# EAGLE schematic BMS Thermistor ECU rev1 (EAGLE 8.4.1)
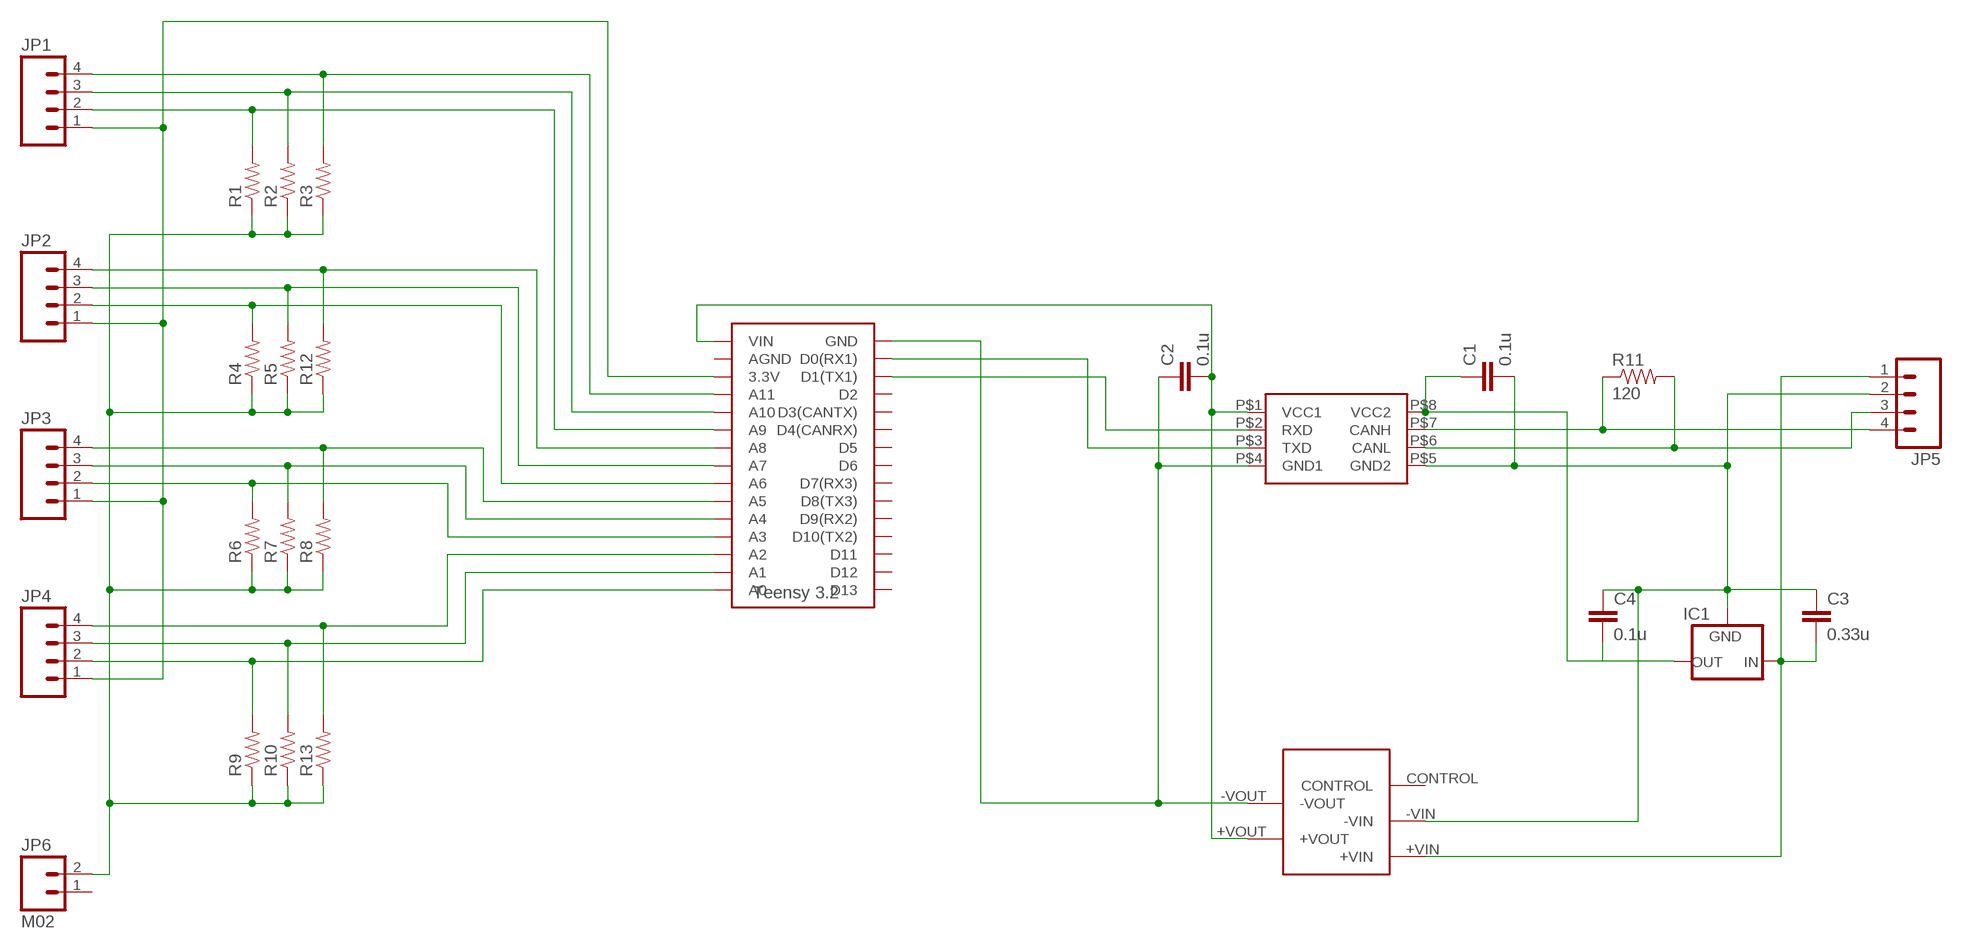
[diagram p0: schematic, sheet 1]

## Parts
C1  0.1u  CAP0805  [0805]
C2  0.1u  CAP0805  [0805]
C3  0.33u  CAP0805  [0805]
C4  0.1u  CAP0805  [0805]
IC1  5VREG_L7805SPACED  [TO-220-SPACED]
JP1  M04  [1X04]
JP2  M04  [1X04]
JP3  M04  [1X04]
JP4  M04  [1X04]
JP5  M04  [1X04]
JP6  M02  [1X02]
R1  RESISTOR0805-RES  [0805]
R2  RESISTOR0805-RES  [0805]
R3  RESISTOR0805-RES  [0805]
R4  RESISTOR0805-RES  [0805]
R5  RESISTOR0805-RES  [0805]
R6  RESISTOR0805-RES  [0805]
R7  RESISTOR0805-RES  [0805]
R8  RESISTOR0805-RES  [0805]
R9  RESISTOR0805-RES  [0805]
R10  RESISTOR0805-RES  [0805]
R11  120  RESISTOR0805-RES  [0805]
R12  RESISTOR0805-RES  [0805]
R13  RESISTOR0805-RES  [0805]
U$1  TEENSY_3.2_12ANALOG  [TEENSY_3.2_12ANALOG]
U$2  ISO1050CAN  [DUB8]
U$3  NCS1S1205SC-12V-5VCONVERTER  [DCDC-CONVERTER]

## Nets
3.3V: JP1.1 JP2.1 JP3.1 JP4.1 U$1.3.3V
N$1: C1.2 C3.1 C4.1 IC1.2(GND) JP5.2 U$2.P$5(GND2) U$3.-VIN
N$2: JP3.3 R7.2 U$1.A4
N$3: JP3.4 R8.2 U$1.A5
N$4: C3.2 IC1.1(IN) JP5.1 U$3.+VIN
N$5: C1.1 C4.2 IC1.3(OUT) U$2.P$8(VCC2)
N$6: JP5.4 R11.1 U$2.P$7(CANH)
N$7: JP5.3 R11.2 U$2.P$6(CANL)
N$8: U$1.D0(RX1) U$2.P$3(TXD)
N$9: U$1.D1(TX1) U$2.P$2(RXD)
N$10: C2.2 U$1.VIN U$2.P$1(VCC1) U$3.+VOUT
N$11: C2.1 U$1.GND U$2.P$4(GND1) U$3.-VOUT
N$12: JP2.4 R12.2 U$1.A8
N$13: JP4.4 R13.2 U$1.A2
THERM1: JP1.2 R1.2 U$1.A9
THERM2: JP1.3 R2.2 U$1.A10
THERM3: JP1.4 R3.2 U$1.A11
THERM4: JP2.2 R4.2 U$1.A6
THERM5: JP2.3 R5.2 U$1.A7
THERM6: JP3.2 R6.2 U$1.A3
THERM9: JP4.2 R9.2 U$1.A0
THERM10: JP4.3 R10.2 U$1.A1
TS_GND: JP6.2 R1.1 R2.1 R3.1 R4.1 R5.1 R6.1 R7.1 R8.1 R9.1 R10.1 R12.1 R13.1
Unconnected: JP6.1 U$1.AGND U$1.D2 U$1.D3(CANTX) U$1.D4(CANRX) U$1.D5 U$1.D6 U$1.D7(RX3) U$1.D8(TX3) U$1.D9(RX2) U$1.D10(TX2) U$1.D11 U$1.D12 U$1.D13 U$3.CONTROL

## Library data of the parts
C1-C4 = HyTechDevices:CAP: Capacitor Standard 0603 ceramic capacitor, and 0.1" leaded capacitor.
IC1 = HyTechDevices:5VREG_L7805: Voltage Regulator Switching 5v regulator Datasheet <http://power.murata.com/data/power/oki-78sr.pdf> Standard 7805 5V regulator. IGO (Input Ground Output). Spark Fun Electronics SKU : COM-00107 Datasheet <http://www.mouser.com/ds/2/308/MC7800-D-94905.pdf>
JP1-JP5 = HyTechDevices:M04: Standard 4-pin 0.1" header. NOTES ON THE VARIANTS LOCK and LOCK_LONGPADS... This footprint was designed to help hold the alignment of a through-hole component (i.e. 6-pin header) while soldering it into place. You may notice that each hole has been shifted either up or down by 0.005 of an inch from it's more standard position (which is a perfectly straight line). This slight alteration caused the pins (the squares in the middle) to touch the edges of the holes. Because they are alternating, it causes a "brace" to hold the component in place. 0.005 has proven to be the perfect amount of "off-center" position when using our standard breakaway headers. Although looks a little odd when you look at the bare footprint, once you have a header in there, the alteration is very hard to notice. Also,if you push a header all the way into place, it is covered up entirely on the bottom side. This idea of altering the position of holes to aid alignment will be further integrated into the Sparkfun Library for other footprints. It can help hold any component with 3 or more connection pins. Note: The Sparkfun version includes many other packages including surface mount that may be of future interest. Source: Sparkfun <https://github.com/sparkfun/SparkFun-Eagle-Libraries>
JP6 = HyTechDevices:M02: Standard 2-pin 0.1" header. NOTES ON THE VARIANTS LOCK and LOCK_LONGPADS... This footprint was designed to help hold the alignment of a through-hole component (i.e. 6-pin header) while soldering it into place. You may notice that each hole has been shifted either up or down by 0.005 of an inch from it's more standard position (which is a perfectly straight line). This slight alteration caused the pins (the squares in the middle) to touch the edges of the holes. Because they are alternating, it causes a "brace" to hold the component in place. 0.005 has proven to be the perfect amount of "off-center" position when using our standard breakaway headers. Although looks a little odd when you look at the bare footprint, once you have a header in there, the alteration is very hard to notice. Also,if you push a header all the way into place, it is covered up entirely on the bottom side. This idea of altering the position of holes to aid alignment will be further integrated into the Sparkfun Library for other footprints. It can help hold any component with 3 or more connection pins. Note: The Sparkfun version includes many other packages including surface mount that may be of future interest. Source: Sparkfun <https://github.com/sparkfun/SparkFun-Eagle-Libraries>
R1-R13 = HyTechDevices:RESISTOR: Resistor Basic schematic elements and footprints for 0603, 1206, and PTH resistors.
U$1 = HyTechDevices:TEENSY_3.2_12ANALOG
U$2 = HyTechDevices:ISO1050CAN
U$3 = HyTechDevices:NCS1S1205SC-12V-5VCONVERTER